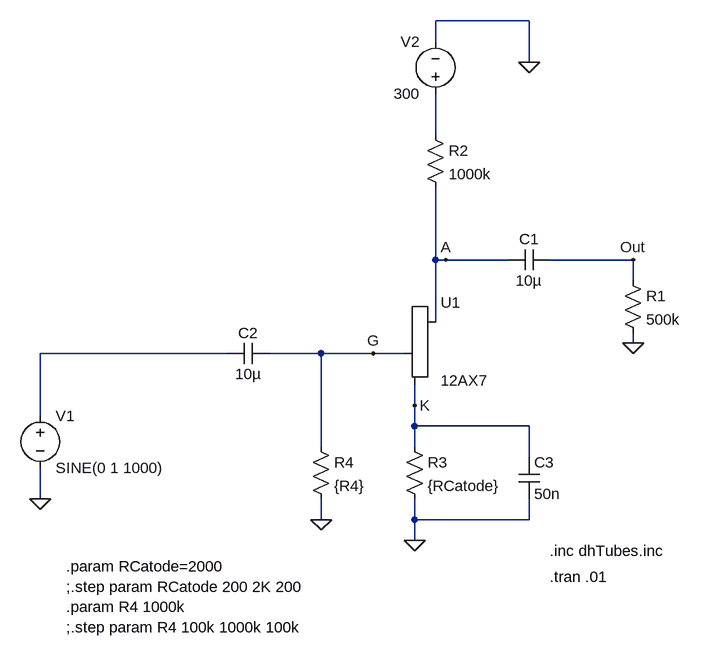
[diagram p0: schematic Triode1.asc]
Triode1.asc, the LTspice schematic file:
Version 4
SHEET 1 880 680
WIRE 384 -336 240 -336
WIRE 240 -304 240 -336
WIRE 384 -272 384 -336
WIRE 240 -160 240 -224
WIRE 240 32 240 -80
WIRE 256 32 240 32
WIRE 352 32 256 32
WIRE 544 32 416 32
WIRE 544 64 544 32
WIRE 240 128 240 32
WIRE 544 160 544 144
WIRE -80 176 -368 176
WIRE 64 176 -16 176
WIRE 144 176 64 176
WIRE 192 176 144 176
WIRE 208 256 208 224
WIRE -368 272 -368 176
WIRE 208 288 208 256
WIRE 384 288 208 288
WIRE 64 320 64 176
WIRE 208 320 208 288
WIRE 384 336 384 288
WIRE -368 400 -368 352
WIRE 64 432 64 400
WIRE 208 432 208 400
WIRE 384 432 384 400
WIRE 384 432 208 432
WIRE 208 464 208 432
FLAG 544 160 0
FLAG -368 400 0
FLAG 384 -272 0
FLAG 64 432 0
FLAG 208 256 K
FLAG 144 176 G
FLAG 256 32 A
FLAG 544 32 Out
FLAG 208 464 0
SYMBOL Misc\\triode 240 176 R0
SYMATTR InstName U1
SYMATTR Value 12AX7
SYMATTR SpiceModel 12AX7
SYMBOL voltage -368 256 R0
WINDOW 123 0 0 Left 0
WINDOW 39 0 0 Left 0
SYMATTR InstName V1
SYMATTR Value SINE(0 1 1000)
SYMBOL voltage 240 -208 R180
WINDOW 0 24 96 Left 2
WINDOW 3 24 16 Left 2
WINDOW 123 0 0 Left 0
WINDOW 39 0 0 Left 0
SYMATTR InstName V2
SYMATTR Value 300
SYMBOL res 528 48 R0
SYMATTR InstName R1
SYMATTR Value 500k
SYMBOL cap 416 16 R90
WINDOW 0 0 32 VBottom 2
WINDOW 3 32 32 VTop 2
SYMATTR InstName C1
SYMATTR Value 10µ
SYMBOL res 224 -176 R0
SYMATTR InstName R2
SYMATTR Value 1000k
SYMBOL cap -16 160 R90
WINDOW 0 0 32 VBottom 2
WINDOW 3 32 32 VTop 2
SYMATTR InstName C2
SYMATTR Value 10µ
SYMBOL res 192 304 R0
SYMATTR InstName R3
SYMATTR Value {RCatode}
SYMBOL res 48 304 R0
SYMATTR InstName R4
SYMATTR Value {R4}
SYMBOL cap 368 336 R0
SYMATTR InstName C3
SYMATTR Value 50n
TEXT 416 480 Left 2 !.inc dhTubes.inc
TEXT 416 520 Left 2 !.tran .01
TEXT -328 504 Left 2 !.param RCatode=2000\n;.step param RCatode 200 2K 200\n.param R4 1000k\n;.step param R4 100k 1000k 100k

The netlist it stands for:
* Triode1.asc
XU1 A G K 12AX7 12AX7
V1 N002 0 SINE(0 1 1000)
V2 N001 0 300
R1 Out 0 500k
C1 Out A 10µ
R2 N001 A 1000k
C2 G N002 10µ
R3 K 0 {RCatode}
R4 G 0 {R4}
C3 K 0 50n
.inc dhTubes.inc
.tran .01
.param RCatode=2000
;.step param RCatode 200 2K 200
.param R4 1000k
;.step param R4 100k 1000k 100k
.backanno
.end